# Altium project LAN7800-Board.PrjPcb
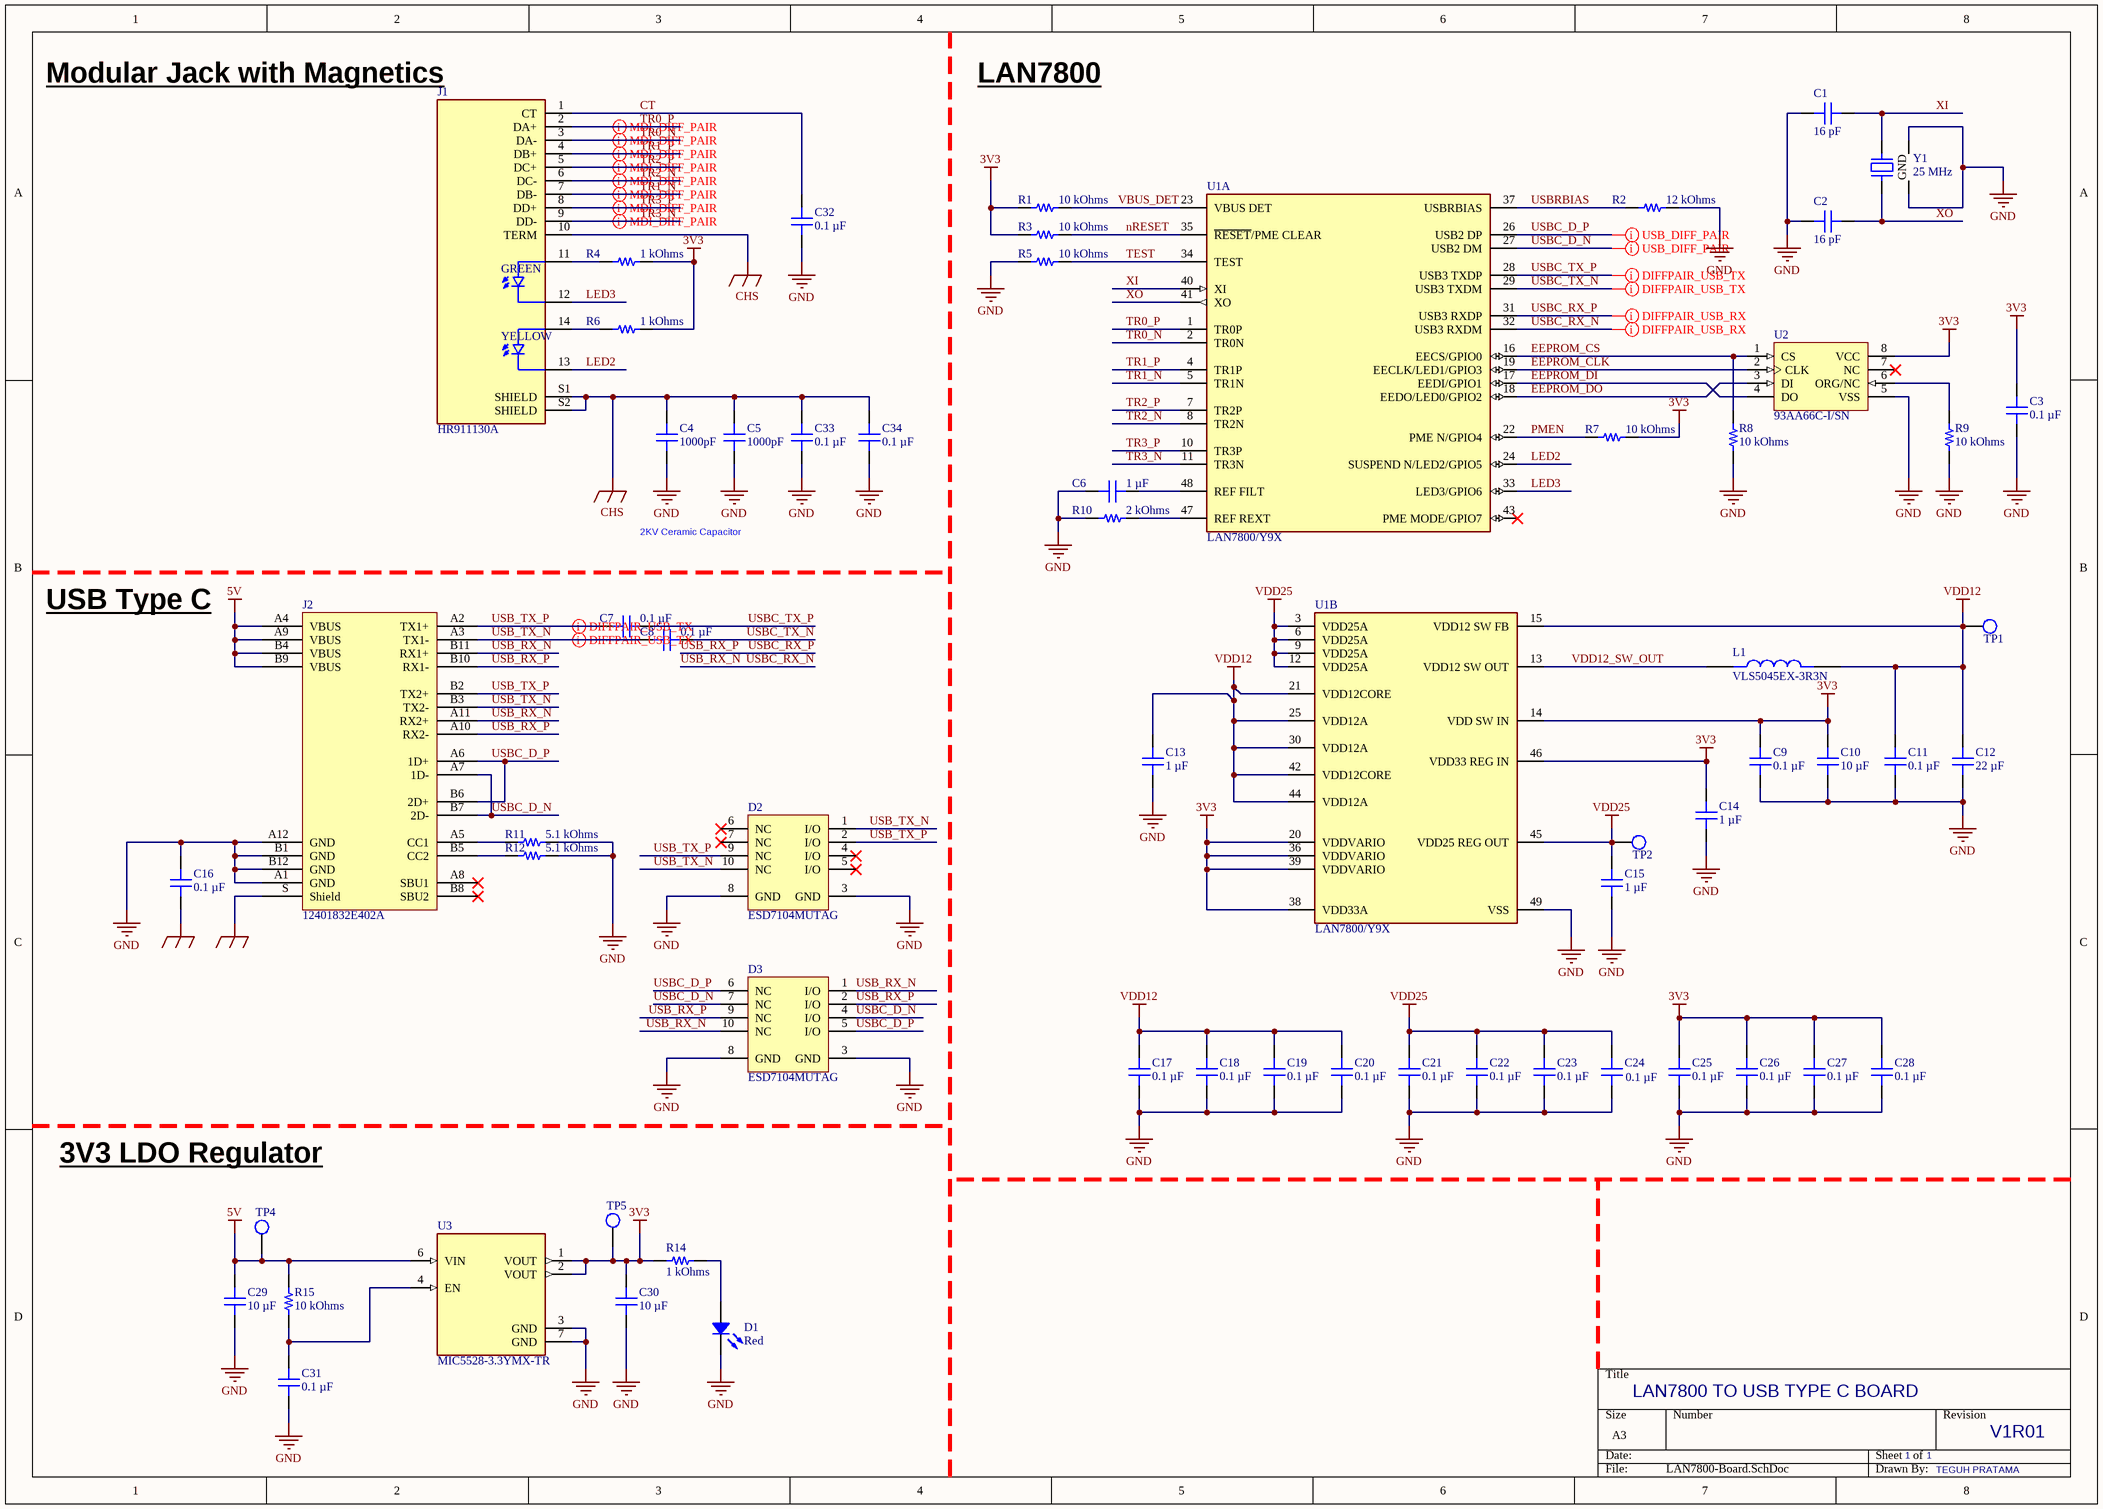
[diagram p0: LAN7800-Board.SchDoc]
PCB_TITLE_1: LAN7800 Board
1 sheet, 62 parts. Net scope: global (net labels, ports and power ports of the same name join across sheets).
Board file: LAN7800-Board.PcbDoc

## Sheet LAN7800-Board.SchDoc
size A3; SheetNumber: 1; SheetTotal: 1

### Parts
C1  16 pF  [CAP 0402_1005]
C2  16 pF  [CAP 0402_1005]
C3  0.1 µF  [CAP 0402_1005]
C4  1000pF  [CAP 1812_4532 2.8MM]
C5  1000pF  [CAP 1812_4532 2.8MM]
C6  1 µF  [CAP 0402_1005]
C7  0.1 µF  [CAP 0402_1005]
C8  0.1 µF  [CAP 0402_1005]
C9  0.1 µF  [CAP 0402_1005]
C10  10 µF  [CAP 0603_1608]
C11  0.1 µF  [CAP 0402_1005]
C12  22 µF  [CAP 0603_1608]
C13  1 µF  [CAP 0402_1005]
C14  1 µF  [CAP 0402_1005]
C15  1 µF  [CAP 0402_1005]
C16  0.1 µF  [CAP 0402_1005]
C17  0.1 µF  [CAP 0402_1005]
C18  0.1 µF  [CAP 0402_1005]
C19  0.1 µF  [CAP 0402_1005]
C20  0.1 µF  [CAP 0402_1005]
C21  0.1 µF  [CAP 0402_1005]
C22  0.1 µF  [CAP 0402_1005]
C23  0.1 µF  [CAP 0402_1005]
C24  0.1 µF  [CAP 0402_1005]
C25  0.1 µF  [CAP 0402_1005]
C26  0.1 µF  [CAP 0402_1005]
C27  0.1 µF  [CAP 0402_1005]
C28  0.1 µF  [CAP 0402_1005]
C29  10 µF  [CAP 0603_1608]
C30  10 µF  [CAP 0603_1608]
C31  0.1 µF  [CAP 0402_1005]
C32  0.1 µF  [CAP 0402_1005]
C33  0.1 µF  [CAP 0402_1005]
C34  0.1 µF  [CAP 0402_1005]
D1  Red  [LED 0603_1608 RED]
D2  ESD7104MUTAG  [ONSC-UDFN-10-517BB-01_V]
D3  ESD7104MUTAG  [ONSC-UDFN-10-517BB-01_V]
J1  HR911130A  [HANRUN_HR911130A]
J2  12401832E402A  [GCT_USB4056-03-A_REVA2]
L1  VLS5045EX-3R3N  [IND_VLS5045EX-3R3N]
R1  10 kOhms  [RES 0402_1005]
R2  12 kOhms  [RES 0402_1005]
R3  10 kOhms  [RES 0402_1005]
R4  1 kOhms  [RES 0402_1005]
R5  10 kOhms  [RES 0402_1005]
R6  1 kOhms  [RES 0402_1005]
R7  10 kOhms  [RES 0402_1005]
R8  10 kOhms  [RES 0402_1005]
R9  10 kOhms  [RES 0402_1005]
R10  2 kOhms  [RES 0402_1005]
R11  5.1 kOhms  [RES 0402_1005]
R12  5.1 kOhms  [RES 0402_1005]
R14  1 kOhms  [RES 0402_1005]
R15  10 kOhms  [RES 0402_1005]
TP1  TestPoint  [Rounded 1.7mm X 1.7mm]  (value not drawn)  (no BOM)
TP2  TestPoint  [Rounded 1.7mm X 1.7mm]  (value not drawn)  (no BOM)
TP4  TestPoint  [Rounded 1.7mm X 1.7mm]  (value not drawn)  (no BOM)
TP5  TestPoint  [Rounded 1.7mm X 1.7mm]  (value not drawn)  (no BOM)
U1  LAN7800/Y9X  [FP-48SQFN-5304-7x7B-IPC_B]  (parts A,B of 2)
U2  93AA66C-I/SN  [SOIC-SN8_N]
U3  MIC5528-3.3YMX-TR  [SON40P120X120X60-7N]
Y1  25 MHz  [EPSON TSX-3225]

### Nets
3V3: C3.2 C9.2 C10.2 C14.2 C25.2 C26.2 C27.2 C28.2 C30.2 R1.2 R3.2 R4.2 R6.2 R7.1 R14.2 TP5.1 U1.14(VDD_SW_IN) U1.20(VDDVARIO) U1.36(VDDVARIO) U1.38(VDD33A) U1.39(VDDVARIO) U1.46(VDD33_REG_IN) U2.8(VCC) U3.1(VOUT) U3.2(VOUT)
5V: C29.2 J2.A4(VBUS) J2.A9(VBUS) J2.B4(VBUS) J2.B9(VBUS) R15.2 TP4.1 U3.6(VIN)
CHS: C4.2 C5.2 C33.2 C34.2 J1.10(TERM) J1.S1(SHIELD) J1.S2(SHIELD)
EARTH: C16.1 J2.S(Shield)
GND: C1.1 C2.1 C3.1 C4.1 C5.1 C6.1 C9.1 C10.1 C11.1 C12.1 C13.1 C14.1 C15.1 C16.2 C17.1 C18.1 C19.1 C20.1 C21.1 C22.1 C23.1 C24.1 C25.1 C26.1 C27.1 C28.1 C29.1 C30.1 C31.1 C32.1 C33.1 C34.1 D1.2 D2.3(GND) D2.8(GND) D3.3(GND) D3.8(GND) J2.A1(GND) J2.A12(GND) J2.B1(GND) J2.B12(GND) R2.2 R5.2 R8.1 R9.1 R10.1 R11.2 R12.2 U1.49(VSS) U2.5(VSS) U3.3(GND) U3.7(GND) Y1.2(GND) Y1.4(GND)
VDD12: C11.2 C12.2 C13.2 C17.2 C18.2 C19.2 C20.2 L1.2 TP1.1 U1.15(VDD12_SW_FB) U1.21(VDD12CORE) U1.25(VDD12A) U1.30(VDD12A) U1.42(VDD12CORE) U1.44(VDD12A)
VDD25: C15.2 C21.2 C22.2 C23.2 C24.2 TP2.1 U1.3(VDD25A) U1.6(VDD25A) U1.9(VDD25A) U1.12(VDD25A) U1.45(VDD25_REG_OUT)
CT: C32.2 J1.1(CT)
EEPROM_CLK: U1.19(EECLK/LED1/GPIO3) U2.2(CLK)
EEPROM_CS: R8.2 U1.16(EECS/GPIO0) U2.1(CS)
EEPROM_DI: U1.17(EEDI/GPIO1) U2.4(DO)
EEPROM_DO: U1.18(EEDO/LED0/GPIO2) U2.3(DI)
LED2: J1.13 U1.24(SUSPEND_N/LED2/GPIO5)
LED3: J1.12 U1.33(LED3/GPIO6)
nRESET: R3.1 U1.35(~{RESET}/PME_CLEAR)
PMEN: R7.2 U1.22(PME_N/GPIO4)
TEST: R5.1 U1.34(TEST)
TR0_N: J1.3(DA-) U1.2(TR0N)
TR0_P: J1.2(DA+) U1.1(TR0P)
TR1_N: J1.7(DB-) U1.5(TR1N)
TR1_P: J1.4(DB+) U1.4(TR1P)
TR2_N: J1.6(DC-) U1.8(TR2N)
TR2_P: J1.5(DC+) U1.7(TR2P)
TR3_N: J1.9(DD-) U1.11(TR3N)
TR3_P: J1.8(DD+) U1.10(TR3P)
USB_RX_N: D3.1(I/O) D3.10(NC) J2.A11(RX2+) J2.B11(RX1+) U1.32(USB3_RXDM)  [also labelled USBC_RX_N]
USB_RX_P: D3.2(I/O) D3.9(NC) J2.A10(RX2-) J2.B10(RX1-) U1.31(USB3_RXDP)  [also labelled USBC_RX_P]
USB_TX_N: C8.2 D2.1(I/O) D2.10(NC) J2.A3(TX1-) J2.B3(TX2-)
USB_TX_P: C7.2 D2.2(I/O) D2.9(NC) J2.A2(TX1+) J2.B2(TX2+)
USBC_D_N: D3.4(I/O) D3.7(NC) J2.A7(1D-) J2.B7(2D-) U1.27(USB2_DM)
USBC_D_P: D3.5(I/O) D3.6(NC) J2.A6(1D+) J2.B6(2D+) U1.26(USB2_DP)
USBC_TX_N: C8.1 U1.29(USB3_TXDM)
USBC_TX_P: C7.1 U1.28(USB3_TXDP)
USBRBIAS: R2.1 U1.37(USBRBIAS)
VBUS_DET: R1.1 U1.23(VBUS_DET)
VDD12_SW_OUT: L1.1 U1.13(VDD12_SW_OUT)
XI: C1.2 U1.40(XI) Y1.3
XO: C2.2 U1.41(XO) Y1.1
NetC6_2: C6.2 U1.48(REF_FILT)
NetC31_2: C31.2 R15.1 U3.4(EN)
NetD1_1: D1.1 R14.1
NetJ1_11: J1.11 R4.1
NetJ1_14: J1.14 R6.1
NetJ2_A5: J2.A5(CC1) R11.1
NetJ2_B5: J2.B5(CC2) R12.1
NetR9_2: R9.2 U2.6(ORG/NC)
NetR10_2: R10.2 U1.47(REF_REXT)

Not connected (* = marked no-connect by the designer): D2 4(I/O)* 5(I/O)* 6(NC)* 7(NC)*; J2 A8(SBU1)* B8(SBU2)*; U1 43(PME_MODE/GPIO7)*; U2 7(NC)*

### Layout directives
differential pair; differential pair class USB_TX: USB_TX_N, USB_TX_P, USBC_TX_N, USBC_TX_P
differential pair; differential pair class USB_DATA: USBC_D_N, USBC_D_P
differential pair; differential pair class USB_RX: USB_RX_N, USB_RX_P
differential pair; differential pair class MDI_DIFF_PAIR: TR0_N, TR0_P, TR1_N, TR1_P, TR2_N, TR2_P, TR3_N, TR3_P

### Notes on the sheet
- Modular Jack with Magnetics
- LAN7800
- 2KV Ceramic Capacitor
- USB Type C
- 3V3 LDO Regulator
- LAN7800 TO USB TYPE C BOARD
- 1
- V1R01
- TEGUH PRATAMA
- (in symbol HR911130A) GREEN; YELLOW

### Library data of the parts
C1 C2 = CBR04C160F5GAC: CAP CER 16PF 50V C0G/NP0 0402; manufacturer: KEMET; Temperature Coefficient: C0G, NP0; Tolerance: ±1%; Part Number: CBR04C160F5GAC; Value: 16 pF; Applications: RF, Microwave, High Frequency; Capacitance: 16 pF; componentlink1description: Datasheet; componentlink1url: https://api.kemet.com/component-edge/download/datasheet/CBR04C160F5GAC.pdf; componentlink2description: DigiKey Link; componentlink2url: https://www.digikey.com/en/products/detail/kemet/CBR04C160F5GAC/3479638; Device Package: 0402 (1005 Metric); Features: High Q, Low Loss, Ultra Low ESR; lastupdated: 1/7/2024 8:04:48 PM; Lifecycle Status: Active; Minimum Order: 1; Mounting Type: Surface Mount, MLCC; Operating Temperature: -55°C ~ 125°C; Package / Case: 0402 (1005 Metric); packaging: TapeAndReel; partid: 1751; Part Status: Active; price: 0.06; series: CBR-SMD RF C0G; Size / Dimension: 0.039" L x 0.020" W (1.00mm x 0.50mm); Supplier 1: DigiKey; Supplier Part Number 1: 399-8829-1-ND; Thickness (Max): 0.022" (0.55mm); Voltage - Rated: 50V
C3 C9 C11 C17-C28 C31-C34 = C0402C104K4RECAUTO: CAP CER 0402 0.1UF 16V X7R 10%; manufacturer: KEMET; Part Number: C0402C104K4RECAUTO; Value: 0.1 µF; Applications: Automotive, ESD Protection; Capacitance: 0.1 µF; componentlink1description: Datasheet; componentlink1url: https://api.kemet.com/component-edge/download/datasheet/C0402C104K4RECAUTO.pdf; componentlink2description: DigiKey Link; componentlink2url: https://www.digikey.com/en/products/detail/kemet/C0402C104K4RECAUTO/8563695; Device Package: 0402 (1005 Metric); lastupdated: 1/6/2024 8:04:39 PM; Lifecycle Status: Active; Minimum Order: 1; Mounting Type: Surface Mount, MLCC; Operating Temperature: -55°C ~ 125°C; Package / Case: 0402 (1005 Metric); packaging: TapeAndReel; partid: 1731; Part Status: Active; price: 0.01; Ratings: AEC-Q200; series: ESD SMD Auto X7R; Size / Dimension: 0.039" L x 0.020" W (1.00mm x 0.50mm); Supplier 1: DigiKey; Supplier Part Number 1: 399-17167-1-ND; Temperature Coefficient: X7R; Thickness (Max): 0.022" (0.55mm); Tolerance: ±10%; Voltage - Rated: 16V
C4 C5 = 1812WC102KAT1A: CAP CER 1000PF 2.5KV X7R 1812; manufacturer: AVX Corporation; Tolerance: ±10%; Voltage - Rated: 2500V (2.5kV); Part Number: 1812WC102KAT1A; Value: 1000pF; Applications: General Purpose; Capacitance: 1000pF; componentlink1description: Datasheet; componentlink1url: http://datasheets.avx.com/AVX-HV_MLCC.pdf; componentlink2description: DigiKey Link; componentlink2url: http://digikey.com/product-detail/en/avx-corporation/1812WC102KAT1A/478-11410-1-ND/8019100; Device Package: 1812 (4532 Metric); Features: High Voltage; lastupdated: 9/2/2020 1:11:13 AM; Lifecycle Status: Active; Minimum Order: 1; Mounting Type: Surface Mount, MLCC; Operating Temperature: -55°C ~ 125°C; Package / Case: 1812 (4532 Metric); packaging: TapeAndReel; Part Status: Active; price: 0.53; series: -; Size / Dimension: 0.181" L x 0.126" W (4.60mm x 3.20mm); Supplier 1: DigiKey; Supplier Part Number 1: 478-11410-1-ND; Temperature Coefficient: X7R; Thickness (Max): 0.110" (2.80mm)
C6 C13-C15 = GRM155C71A105KE11D: CAP CER 1UF 10V X7S 0402; manufacturer: Murata Electronics; Tolerance: ±10%; Part Number: GRM155C71A105KE11D; Value: 1 µF; Applications: General Purpose; Capacitance: 1 µF; componentlink1description: Datasheet; componentlink1url: https://search.murata.co.jp/Ceramy/image/img/A01X/G101/ENG/GRM155C71A105KE11-01.pdf; componentlink2description: DigiKey Link; componentlink2url: https://www.digikey.com/en/products/detail/murata-electronics/GRM155C71A105KE11D/6606086; Device Package: 0402 (1005 Metric); lastupdated: 1/7/2024 8:04:48 PM; Lifecycle Status: Active; Minimum Order: 1; Mounting Type: Surface Mount, MLCC; Operating Temperature: -55°C ~ 125°C; Package / Case: 0402 (1005 Metric); packaging: TapeAndReel; partid: 1749; Part Status: Active; price: 0.01; series: GRM; Size / Dimension: 0.039" L x 0.020" W (1.00mm x 0.50mm); Supplier 1: DigiKey; Supplier Part Number 1: 490-14457-1-ND; Temperature Coefficient: X7S; Thickness (Max): 0.024" (0.60mm); Voltage - Rated: 10V
C7 C8 C16 = CGA2B3X5R1H104M050BB: CAP CER 0.1UF 50V X5R 0402; manufacturer: TDK Corporation; Tolerance: ±20%; Part Number: CGA2B3X5R1H104M050BB; Value: 0.1 µF; Applications: Automotive; Capacitance: 0.1 µF; componentlink1description: Datasheet; componentlink1url: https://product.tdk.com/info/en/catalog/datasheets/mlcc_automotive_general_en.pdf?ref_disty=digikey; componentlink2description: DigiKey Link; componentlink2url: https://www.digikey.com/en/products/detail/tdk-corporation/CGA2B3X5R1H104M050BB/3949450; Device Package: 0402 (1005 Metric); lastupdated: 1/6/2024 8:04:39 PM; Lifecycle Status: Active; Minimum Order: 1; Mounting Type: Surface Mount, MLCC; Operating Temperature: -55°C ~ 85°C; Package / Case: 0402 (1005 Metric); packaging: TapeAndReel; partid: 1792; Part Status: Active; price: 0.01; Ratings: AEC-Q200; series: CGA; Size / Dimension: 0.039" L x 0.020" W (1.00mm x 0.50mm); Supplier 1: DigiKey; Supplier Part Number 1: 445-12214-1-ND; Temperature Coefficient: X5R; Thickness (Max): 0.022" (0.55mm); Voltage - Rated: 50V
C10 C29 C30 = GRT188R61C106ME13D: CAP CER 10UF 16V X5R 0603; manufacturer: Murata Electronics; Tolerance: ±20%; Part Number: GRT188R61C106ME13D; Value: 10 µF; Applications: Automotive; Capacitance: 10 µF; componentlink1description: Datasheet; componentlink1url: https://search.murata.co.jp/Ceramy/image/img/A01X/G101/ENG/GRT188R61C106ME13-01.pdf; componentlink2description: DigiKey Link; componentlink2url: https://www.digikey.com/en/products/detail/murata-electronics/GRT188R61C106ME13D/5416740; Device Package: 0603 (1608 Metric); lastupdated: 1/7/2024 8:10:13 PM; Lifecycle Status: Active; Minimum Order: 1; Mounting Type: Surface Mount, MLCC; Operating Temperature: -55°C ~ 85°C; Package / Case: 0603 (1608 Metric); packaging: TapeAndReel; partid: 2515; Part Status: Active; price: 0.06; Ratings: AEC-Q200; series: GRT; Size / Dimension: 0.063" L x 0.031" W (1.60mm x 0.80mm); Supplier 1: DigiKey; Supplier Part Number 1: 490-12318-1-ND; Temperature Coefficient: X5R; Thickness (Max): 0.035" (0.90mm); Voltage - Rated: 16V
C12 = C1608X5R1A226M080AC: CAP CER 22UF 10V X5R 0603; manufacturer: TDK Corporation; Tolerance: ±20%; Part Number: C1608X5R1A226M080AC; Value: 22 µF; Applications: General Purpose; Capacitance: 22 µF; componentlink1description: Datasheet; componentlink1url: https://product.tdk.com/info/en/catalog/datasheets/mlcc_commercial_general_en.pdf?ref_disty=digikey; componentlink2description: DigiKey Link; componentlink2url: https://www.digikey.com/en/products/detail/tdk-corporation/C1608X5R1A226M080AC/3661560; Device Package: 0603 (1608 Metric); Features: Low ESL; lastupdated: 1/7/2024 8:10:13 PM; Lifecycle Status: Active; Minimum Order: 1; Mounting Type: Surface Mount, MLCC; Operating Temperature: -55°C ~ 85°C; Package / Case: 0603 (1608 Metric); packaging: TapeAndReel; partid: 2684; Part Status: Active; price: 0.08; series: C; Size / Dimension: 0.063" L x 0.031" W (1.60mm x 0.80mm); Supplier 1: DigiKey; Supplier Part Number 1: 445-9077-1-ND; Temperature Coefficient: X5R; Thickness (Max): 0.039" (1.00mm); Voltage - Rated: 10V
D1 = CSL0902VT1C: HIGH BRIGHTNESS LENS TYPE, RED C; Manufacturer: Rohm Semiconductor; Current - Test: 20mA; Lens Color: Colorless; Lens Size: 1.14mm x 0.80mm; Lens Style: Rectangle with Domed Top; Lens Transparency: Clear; Millicandela Rating: 280mcd; Voltage - Forward (Vf) (Typ): 2.1V; Wavelength - Dominant: 630nm; Part Number: CSL0902VT1C; Color: Red; ComponentLink1Description: Datasheet; ComponentLink1URL: https://fscdn.rohm.com/en/products/databook/datasheet/opto/led/chip_mono/CSL0902VT1(C)-e.pdf; ComponentLink2Description: DigiKey Link; ComponentLink2URL: https://www.digikey.com/en/products/detail/rohm-semiconductor/CSL0902VT1C/16285849; Device Package: 0603 (1608 Metric); Height (Max): 1.34mm; LastUpdated: 1/6/2024 9:33:05 PM; Lifecycle Status: Active; Minimum Order: 1; Mounting Type: Surface Mount; Package / Case: 0603 (1608 Metric); Packaging: TapeAndReel; PartId: 1154; Part Status: Active; Price: 0.18; Series: -; Size / Dimension: 1.60mm L x 0.80mm W; Supplier 1: DigiKey; Supplier Part Number 1: 846-CSL0902VT1CCT-ND; Supplier Device Package: 0603; Value: Red
D2 D3 = ESD7104MUTAG: Transient Voltage Suppressor, Low Capacitance ESD Protection for High Speed Data, 10-Pin UDFN, Pb-Free, Tape and Reel; Manufacturer: On Semiconductor; IR Max (uA): 1; Number of Lines: 4; VRWM Max (V): 5; Direction: Bidirectional; V(BR) Min (V): 5.5; PackageDescription: 10-Pin Small Outline No-Lead, Body 2.5 x 1 mm, Pitch 0.5 mm; ComponentLink3URL: http://www.onsemi.com/pub_link/Collateral/517BB.PDF; PackageReference: UDFN-10-517BB-01; Mounting Technology: Surface Mount; PartNumber: ESD7104MUTAG; ComponentLink1URL: http://www.onsemi.com/; ComponentLink1Description: Manufacturer URL; DatasheetVersion: Rev. 2; ComponentLink2Description: Datasheet; ComponentLink2URL: http://www.onsemi.cn/pub_link/Collateral/ESD7104-D.PDF; PackageVersion: Rev. O, 11/2009; Packing: Tape and Reel; RoHS: Pb-Free; ComponentLink3Description: Package Specification
J1 = HR911130A: Gigabit Ethernet with Magnetics; MF: hanrun; SnapEDA_Link: https://www.snapeda.com/parts/HR911130A/HanRun/view-part/?ref=snap; MP: HR911130A; Price: None; Package: None; Check_prices: https://www.snapeda.com/parts/HR911130A/HanRun/view-part/?ref=eda; Value: *; Availability: Not in stock
J2 = USB4056-03-A: 24 Position Hybrid Top Mount USB Type C 3.2 Gen Receptacle; Manufacturer: Global Connector Technology; Supplier: Future Electronics; Supplier Part Number: 2158115; Manufacturer Part Number: USB4056-03-A; RoHS: No; Category: Connectors; Stock: 1000; Pricing: 1000=0,535, 2000=0,525, 3000=0,515, 4000=0,51, 5000=0,495 (USD); ComponentLink1URL: https://datasheet.octopart.com/USB4056-03-A-Global-Connector-Technology-datasheet-169978561.pdf?src-supplier=Future+Electronics; ComponentLink1Description: https://datasheet.octopart.com/USB4056-03-A-Global-Connector-Technology-datasheet-169978561.pdf?src-supplier=Future+Electronics
L1 = VLS5045EX-3R3N: General Purpose Inductor, 3.3uH, 30%, 1 Element, Ferrite-Core, SMD, 2020; MF: TDK; Availability: In Stock; Value: *; Package: NON STANDARD-2 TDK; Price: None; SnapEDA_Link: https://www.snapeda.com/parts/VLS5045EX-3R3N/TDK/view-part/?ref=snap; Purchase-URL: https://pricing.snapeda.com/search/part/VLS5045EX-3R3N/?ref=eda; MP: VLS5045EX-3R3N; Check_prices: https://www.snapeda.com/parts/VLS5045EX-3R3N/TDK/view-part/?ref=eda; Supplier: Future Electronics; Supplier Part Number: 8138322; Manufacturer: TDK; Manufacturer Part Number: VLS5045EX-3R3N; RoHS: Yes; Category: Fixed Inductors; Pricing: 1500=0,147, 3000=0,144, 4500=0,142, 7500=0,14, 15000=0,136 (USD); Inductor Type: GENERAL PURPOSE INDUCTOR; RoHS Compliant: Yes; Reach SVHC Compliant: Yes; ComponentLink1URL: https://datasheet.ciiva.com:443/pdfs/VipMasterIC/IC/TDKC/TDKC-S-A0005738305/TDKC-S-A0005738305-1.pdf?src-supplier=IHS+Markit; ComponentLink1Description: https://datasheet.ciiva.com:443/pdfs/VipMasterIC/IC/TDKC/TDKC-S-A0005738305/TDKC-S-A0005738305-1.pdf?src-supplier=IHS+Markit; ComponentLink2URL: http://www.farnell.com/datasheets/2339796.pdf?src-supplier=Farnell; ComponentLink2Description: http://www.farnell.com/datasheets/2339796.pdf?src-supplier=Farnell; ComponentLink3URL: https://media.digikey.com/pdf/Data%20Sheets/TDK%20PDFs/VLS-EX_Series_Br.pdf?src-supplier=Digikey; ComponentLink3Description: https://media.digikey.com/pdf/Data%20Sheets/TDK%20PDFs/VLS-EX_Series_Br.pdf?src-supplier=Digikey; ComponentLink4URL: http://www.farnell.com/datasheets/2339796.pdf?src-supplier=Element14; ComponentLink4Description: http://www.farnell.com/datasheets/2339796.pdf?src-supplier=Element14; ComponentLink5URL: http://www.farnell.com/datasheets/2339796.pdf?src-supplier=Newark; ComponentLink5Description: http://www.farnell.com/datasheets/2339796.pdf?src-supplier=Newark
R1 R3 R5 R7-R9 R15 = RP73PF1E10KBTD: RES 10K OHM 0.1% 1/10W 0402; Manufacturer: TE Connectivity Passive Product; Power (Watts): 0.1W, 1/10W; Temperature Coefficient: ±25ppm/°C; Part Number: RP73PF1E10KBTD; Value: 10 kOhms; ComponentLink1Description: Datasheet; ComponentLink1URL: https://www.te.com/commerce/DocumentDelivery/DDEController?Action=srchrtrv&DocNm=1773272&DocType=DS&DocLang=English; ComponentLink2Description: DigiKey Link; ComponentLink2URL: https://www.digikey.com/en/products/detail/te-connectivity-passive-product/RP73PF1E10KBTD/8260957; Composition: Thin Film; Device Package: 0402 (1005 Metric); Height - Seated (Max): 0.014" (0.35mm); LastUpdated: 1/6/2024 8:29:32 PM; Lifecycle Status: Active; Minimum Order: 1; Number of Terminations: 2; Operating Temperature: -55°C ~ 155°C; Package / Case: 0402 (1005 Metric); Packaging: TapeAndReel; PartId: 2434; Part Status: Active; Price: 0.08; Resistance: 10 kOhms; Series: RP73, Holsworthy; Size / Dimension: 0.039" L x 0.020" W (1.00mm x 0.50mm); Supplier 1: DigiKey; Supplier Part Number 1: A127415CT-ND; Supplier Device Package: 0402; Tolerance: ±0.1%
R2 = CPF0402B12KE1: RES SMD 12K OHM 0.1% 1/16W 0402; Manufacturer: TE Connectivity Passive Product; Power (Watts): 0.063W, 1/16W; Temperature Coefficient: ±25ppm/°C; Part Number: CPF0402B12KE1; Value: 12 kOhms; ComponentLink1Description: Datasheet; ComponentLink1URL: https://www.te.com/commerce/DocumentDelivery/DDEController?Action=srchrtrv&DocNm=1773200&DocType=DS&DocLang=English; ComponentLink2Description: DigiKey Link; ComponentLink2URL: https://www.digikey.com/en/products/detail/te-connectivity-passive-product/CPF0402B12KE1/2381830; Composition: Thin Film; Device Package: 0402 (1005 Metric); Height - Seated (Max): 0.014" (0.35mm); LastUpdated: 1/7/2024 8:29:34 PM; Lifecycle Status: Active; Minimum Order: 1; Number of Terminations: 2; Operating Temperature: -55°C ~ 155°C; Package / Case: 0402 (1005 Metric); Packaging: TapeAndReel; PartId: 3318; Part Status: Active; Price: 0.13; Resistance: 12 kOhms; Series: CPF, Neohm; Size / Dimension: 0.039" L x 0.020" W (1.00mm x 0.50mm); Supplier 1: DigiKey; Supplier Part Number 1: A102603CT-ND; Supplier Device Package: 0402; Tolerance: ±0.1%
R4 R6 R14 = AT0402BRD071KL: RES SMD 1K OHM 0.1% 1/16W 0402; Manufacturer: Yageo; Power (Watts): 0.063W, 1/16W; Temperature Coefficient: ±25ppm/°C; Part Number: AT0402BRD071KL; Value: 1 kOhms; ComponentLink1Description: Datasheet; ComponentLink1URL: http://www.yageo.com/documents/recent/PYu-AT_51_RoHS_L_5.pdf; ComponentLink2Description: DigiKey Link; ComponentLink2URL: https://www.digikey.com/en/products/detail/yageo/AT0402BRD071KL/5138607; Composition: Thin Film; Device Package: 0402 (1005 Metric); Features: Anti-Sulfur, Automotive AEC-Q200, Moisture Resistant; Height - Seated (Max): 0.014" (0.35mm); Lifecycle Status: Active; Minimum Order: 1; Number of Terminations: 2; Operating Temperature: -55°C ~ 155°C; Package / Case: 0402 (1005 Metric); Packaging: TapeAndReel; PartId: 2462; Part Status: Active; Price: 0.08; Ratings: AEC-Q200; Resistance: 1 kOhms; Series: AT; Size / Dimension: 0.039" L x 0.020" W (1.00mm x 0.50mm); Supplier 1: DigiKey; Supplier Part Number 1: YAG2088CT-ND; Supplier Device Package: 0402; Tolerance: ±0.1%
  R4 R6: LastUpdated: 1/7/2024 8:29:36 PM
  R14: LastUpdated: 1/6/2024 8:29:32 PM
R10 = CPF0402B2K0E1: RES SMD 2K OHM 0.1% 1/16W 0402; Manufacturer: TE Connectivity Passive Product; Power (Watts): 0.063W, 1/16W; Temperature Coefficient: ±25ppm/°C; Part Number: CPF0402B2K0E1; Value: 2 kOhms; ComponentLink1Description: Datasheet; ComponentLink1URL: https://www.te.com/commerce/DocumentDelivery/DDEController?Action=srchrtrv&DocNm=1773200&DocType=DS&DocLang=English; ComponentLink2Description: DigiKey Link; ComponentLink2URL: https://www.digikey.com/en/products/detail/te-connectivity-passive-product/CPF0402B2K0E1/2381811; Composition: Thin Film; Device Package: 0402 (1005 Metric); Height - Seated (Max): 0.014" (0.35mm); LastUpdated: 1/7/2024 8:29:34 PM; Lifecycle Status: Active; Minimum Order: 1; Number of Terminations: 2; Operating Temperature: -55°C ~ 155°C; Package / Case: 0402 (1005 Metric); Packaging: TapeAndReel; PartId: 3338; Part Status: Active; Price: 0.13; Resistance: 2 kOhms; Series: CPF, Neohm; Size / Dimension: 0.039" L x 0.020" W (1.00mm x 0.50mm); Supplier 1: DigiKey; Supplier Part Number 1: A102762CT-ND; Supplier Device Package: 0402; Tolerance: ±0.1%
R11 R12 = RC0402JR-075K1L: RES 5.1K OHM 5% 1/16W 0402; Manufacturer: Yageo; Power (Watts): 0.063W, 1/16W; Temperature Coefficient: ±100ppm/°C; Part Number: RC0402JR-075K1L; Value: 5.1 kOhms; ComponentLink1Description: Datasheet; ComponentLink1URL: https://www.yageo.com/upload/media/product/productsearch/datasheet/rchip/PYu-RC_Group_51_RoHS_L_10.pdf; ComponentLink2Description: DigiKey Link; ComponentLink2URL: https://www.digikey.com/en/products/detail/yageo/RC0402JR-075K1L/726487; Composition: Thick Film; Device Package: 0402 (1005 Metric); Features: Moisture Resistant; Height - Seated (Max): 0.016" (0.40mm); LastUpdated: 1/6/2024 8:29:23 PM; Lifecycle Status: Active; Minimum Order: 1; Number of Terminations: 2; Operating Temperature: -55°C ~ 155°C; Package / Case: 0402 (1005 Metric); Packaging: CutTape; PartId: 4786; Part Status: Active; Price: 0.01; Resistance: 5.1 kOhms; Series: RC_L; Size / Dimension: 0.039" L x 0.020" W (1.00mm x 0.50mm); Supplier 1: DigiKey; Supplier Part Number 1: 311-5.1KJRCT-ND; Supplier Device Package: 0402; Tolerance: ±5%
U1 = LAN7800/Y9X: USB Bus Controller, CMOS; Manufacturer: Microchip; Operating Supply Current: 4mA; Min Operating Temperature: 0°C; Series: -; Max Operating Temperature: 70°C; Packaging: Tray; RoHS Compliant: Yes; Supplier: Digikey; Supplier Part Number: LAN7800/Y9X-ND; Manufacturer Part Number: LAN7800/Y9X; RoHS: Yes; Category: Ethernet Interface ICs; Stock: 606; Pricing: 1=8,68, 25=7,23, 100=6,9875 (USD); Terminal Finish: Tin; Technology: CMOS; JESD-609 Code: e3; Reach SVHC Compliant: Yes; ComponentLink1URL: https://datasheet.ciiva.com:443/pdfs/VipMasterIC/IC/MCHP/MCHP-S-A0007073606/MCHP-S-A0007073606-1.pdf?src-supplier=IHS+Markit; ComponentLink1Description: https://datasheet.ciiva.com:443/pdfs/VipMasterIC/IC/MCHP/MCHP-S-A0007073606/MCHP-S-A0007073606-1.pdf?src-supplier=IHS+Markit; ComponentLink2URL: http://www.microchip.com/mymicrochip/filehandler.aspx?ddocname=en588570&src-supplier=Digikey; ComponentLink2Description: http://www.microchip.com/mymicrochip/filehandler.aspx?ddocname=en588570&src-supplier=Digikey; ComponentLink3URL: https://datasheet.octopart.com/LAN7800-Y9X-Microchip-datasheet-102166462.pdf?src-supplier=Newark; ComponentLink3Description: https://datasheet.octopart.com/LAN7800-Y9X-Microchip-datasheet-102166462.pdf?src-supplier=Newark; ComponentLink4URL: https://datasheet.octopart.com/LAN7800-Y9X-Microchip-datasheet-78799795.pdf?src-supplier=TME; ComponentLink4Description: https://datasheet.octopart.com/LAN7800-Y9X-Microchip-datasheet-78799795.pdf?src-supplier=TME
U2 = 93AA66C-I/SN: Microwire Serial EEPROM Family, 1.8 to 5.5V, 3 MHz, -40°Cto 125°C, SOIC-8, RoHS; Manufacturer: Microchip; Min Supply Voltage: 1.8V; Frequency: 3MHz; Interface: 2-Wire,Serial,3-WIRE,MICROWIRE; Memory Size: 4Kb; Clock Frequency: 1MHz; Access Time-Max: 200ns; Write Protection: YES; Supply Current: 2mA; Access Time: 6ms; Code_IPC: SOIC127P600-8; PackageReference: SOIC-SN8; DatasheetVersion: revD, May-2008; Code_JEDEC: MS-012; PackageDescription: 8-Lead Plastic Small Outline (SN) - Narrow, 3.90mm Body [SOIC]; PackageVersion: revBB, Aug-2009; Supplier 1: Avnet; Manufacturer Part Number: 93AA66C-I/SN; RoHS: Yes; Category: EEPROM; Stock 1: 75; Pricing 1: 100=0.348 (USD); Mounting Technology: Surface Mount; Case/Package: SOIC; Pins: 8; Contact Plating: Tin,Matte; Min Operating Temperature: -40°C; Max Operating Temperature: 85°C; Packaging: Rail/Tube; Max Supply Voltage: 5.5V; Package Quantity: 100; Density: 4Kb; Memory Format: EEPROM; Termination: SMD/SMT; Length: 4.9mm; Width: 3.9mm; Height: 1.25mm; Lead Free: Lead Free; RoHS Compliant: Yes; Reach SVHC Compliant: No; ComponentLink1URL: https://datasheet.ciiva.com/1155/1561728-1155819.pdf?src-supplier=Element14; ComponentLink1Description: https://datasheet.ciiva.com/1155/1561728-1155819.pdf?src-supplier=Element14
U3 = MIC5528-3.3YMX-TR: Single 500mA LDO w/ Auto Discharge & Internal Enable Pulldown; Manufacturer: Microchip; Output Voltage: 3.3V; Dropout Voltage: 260mV; Number of Regulators: 1; Min Current Limit: 525mA; Supplier 1: Mouser; Manufacturer Part Number: MIC5528-3.3YMX-TR; RoHS: Yes; Category: Voltage Regulators - Linear; Stock 1: 5009; Pricing 1: 1=0,27000, 10=0,26500, 50=0,23400, 100=0,21200, 1000=0,21200, 10000=0,21200 (USD); Mount: Surface Mount; Min Operating Temperature: -40°C; Max Operating Temperature: 125°C; Packaging: Tape and Reel; Output Current: 500mA; Package Quantity: 5000; RoHS Compliant: Yes; ComponentLink1URL: http://www.microchip.com/mymicrochip/filehandler.aspx?ddocname=en580311&src-supplier=Digi-Key; ComponentLink1Description: http://www.microchip.com/mymicrochip/filehandler.aspx?ddocname=en580311&src-supplier=Digi-Key; Supplier Part Number 1: 998-MIC5528-3.3YMXTR
Y1 = TSX-3225 25.0000MF20X-AJ3: CRYSTAL 25.0000MHZ 8PF SMD; Manufacturer: EPSON; ESR (Equivalent Series Resistance): 40 Ohms; Frequency Stability: ±20ppm; Frequency Tolerance: ±10ppm; Operating Mode: Fundamental; Part Number: TSX-3225 25.0000MF20X-AJ3; ComponentLink1Description: Datasheet; ComponentLink1URL: https://support.epson.biz/td/api/doc_check.php?dl=brief_TSX-3225&lang=en; ComponentLink2Description: DigiKey Link; ComponentLink2URL: https://www.digikey.com/en/products/detail/epson/TSX-3225-25-0000MF20X-AJ3/5260885; Frequency: 25 MHz; Height - Seated (Max): 0.024" (0.60mm); LastUpdated: 1/7/2024 9:31:50 PM; Lifecycle Status: Active; Load Capacitance: 8pF; Minimum Order: 1; Mounting Type: Surface Mount; Operating Temperature: -40°C ~ 85°C; Package / Case: 4-SMD, No Lead; Packaging: TapeAndReel; PartId: 431; Part Status: Active; Price: 0.44; Series: TSX-3225; Size / Dimension: 0.126" L x 0.098" W (3.20mm x 2.50mm); Supplier 1: DigiKey; Supplier Part Number 1: SER4376CT-ND; Type: MHz Crystal; Value: 25 MHz

## Assembly variants
EEPROM-B-Series: not fitted R9; alternate parts U2 -> 93LC66BT-I/SN